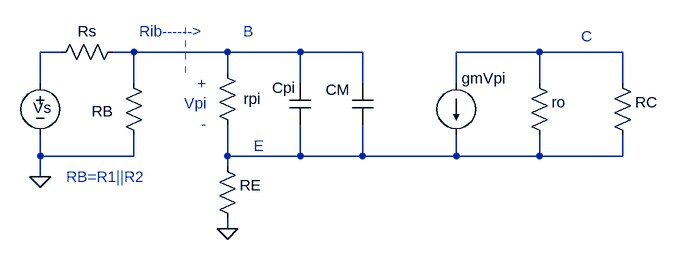
[diagram p0: schematic blitz01_cap_small-signal.asc]
blitz01_cap_small-signal.asc, the LTspice schematic file:
Version 4
SHEET 1 880 680
WIRE -272 -32 -304 -32
WIRE -160 -32 -192 -32
WIRE -16 -32 -160 -32
WIRE 96 -32 -16 -32
WIRE 192 -32 96 -32
WIRE 464 -32 336 -32
WIRE 592 -32 464 -32
WIRE -16 0 -16 -32
WIRE -304 16 -304 -32
WIRE -160 16 -160 -32
WIRE 96 16 96 -32
WIRE 192 16 192 -32
WIRE 336 16 336 -32
WIRE 464 16 464 -32
WIRE 592 16 592 -32
WIRE -304 128 -304 96
WIRE -160 128 -160 96
WIRE -160 128 -304 128
WIRE -16 128 -16 80
WIRE 96 128 96 80
WIRE 96 128 -16 128
WIRE 192 128 192 80
WIRE 192 128 96 128
WIRE 336 128 336 96
WIRE 336 128 192 128
WIRE 464 128 464 96
WIRE 464 128 336 128
WIRE 592 128 592 96
WIRE 592 128 464 128
WIRE -16 144 -16 128
WIRE -304 160 -304 128
WIRE -16 240 -16 224
FLAG -16 240 0
FLAG -304 160 0
SYMBOL res 0 96 R180
WINDOW 0 -36 56 Left 2
WINDOW 3 36 40 Left 2
SYMATTR InstName rpi
SYMATTR Value ""
SYMBOL res 448 0 R0
WINDOW 0 35 45 Left 2
SYMATTR InstName ro
SYMATTR Value ""
SYMBOL cap 80 16 R0
WINDOW 0 -27 7 Left 2
SYMATTR InstName Cpi
SYMATTR Value ""
SYMBOL cap 208 80 R180
WINDOW 0 35 54 Left 2
WINDOW 3 24 -13 Left 2
SYMATTR InstName CM
SYMATTR Value ""
SYMBOL current 336 16 R0
WINDOW 0 8 -8 Left 2
SYMATTR InstName gmVpi
SYMATTR Value ""
SYMBOL res 576 0 R0
WINDOW 0 35 45 Left 2
SYMATTR InstName RC
SYMATTR Value ""
SYMBOL res -32 128 R0
WINDOW 0 35 45 Left 2
SYMATTR InstName RE
SYMATTR Value ""
SYMBOL res -176 0 R0
WINDOW 0 -49 59 Left 2
SYMATTR InstName RB
SYMATTR Value ""
SYMBOL res -176 -48 R90
WINDOW 0 0 56 VBottom 2
WINDOW 3 32 56 VTop 2
SYMATTR InstName Rs
SYMATTR Value ""
SYMBOL voltage -304 0 R0
WINDOW 0 -11 54 Left 2
SYMATTR InstName Vs
SYMATTR Value ""
TEXT 8 -64 Left 2 ;B
TEXT 24 112 Left 2 ;E
TEXT 528 -56 Left 2 ;C
TEXT -48 16 Right 2 ;+\nVpi\n-
TEXT -264 160 Left 2 ;RB=R1||R2
TEXT -152 -64 Left 2 ;Rib------>
LINE Normal -80 0 -80 -80 2

The netlist it stands for:
* blitz01_cap_small-signal.asc
rpi N004 N002
ro N003 N004
Cpi N002 N004
CM N004 N002
I§gmVpi N003 N004
RC N003 N004
RE N004 0
RB N002 0
Rs N002 N001
Vs N001 0
* B
* E
* C
* +
* Vpi
* -
* RB=R1||R2
* Rib------>
.backanno
.end